# EAGLE schematic DC-Boost 12-24v (EAGLE 7.1.0)
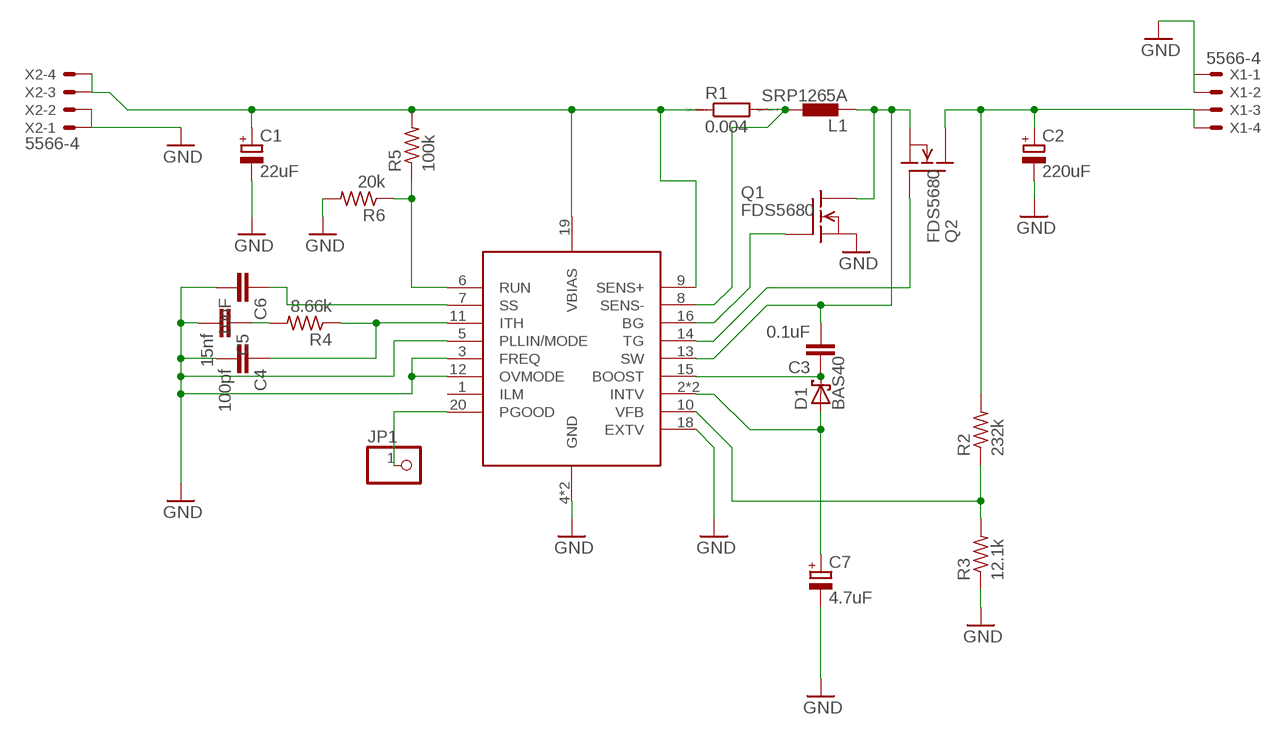
[diagram p0: schematic, sheet 1]

## Parts
C1  22uF  CPOL-EUE2-5  [E2-5]
C2  220uF  CPOL-EUTT5D10  [TT5D10]
C3  0.1uF  C5/3  [C5B3]
C4  100pf  C5/3.5  [C5B3.5]
C5  15nf  C2,5-3  [C2.5-3]
C6  10nF  C5/3  [C5B3]
C7  4.7uF  CPOL-EUE2-5  [E2-5]
D1  BAS40  [SOT23]
JP1  PINHD-1X1  [1X01]
L1  SRP1265A  [SRP1265]
Q1  FDS5680  [SO-8]
Q2  FDS5680  [SO-8]
R1  0.004  RR2512  [R2512]
R2  232k  R-US_0207/10  [0207/10]
R3  12.1k  R-US_0207/10  [0207/10]
R4  8.66k  R-US_0207/10  [0207/10]
R5  100k  R-US_0207/10  [0207/10]
R6  20k  R-US_0207/10  [0207/10]
U$1  LTC3769  [TSSOP-20]
X1  5566-4  [5566-4]
X2  5566-4  [5566-4]

## Nets
GND: C1.- C2.- C4.2 C5.2 C6.2 C7.- Q1.1(S) Q1.2(S) Q1.3(S) R3.1 R6.2 U$1.3(FREQ) U$1.4(GND) U$1.5(PLLIN/MODE) U$1.12(OVMODE) U$1.18(EXTV) U$1.21(GND) X1.1 X1.2 X2.1 X2.2
N$1: C6.1 U$1.7(SS)
N$2: C4.1 R4.1 U$1.11(ITH)
N$3: C5.1 R4.2
N$4: R2.1 R3.2 U$1.10(VFB)
N$5: Q2.4(G) U$1.14(TG)
N$6: C2.+ Q2.5(D) Q2.6(D) Q2.7(D) Q2.8(D) R2.2 X1.3 X1.4
N$7: R5.1 R6.1 U$1.6(RUN)
N$8: Q1.4(G) U$1.16(BG)
N$9: L1.P$3 R1.2 U$1.8(SENS-)
N$10: C3.2 L1.P$1 Q1.5(D) Q1.6(D) Q1.7(D) Q1.8(D) Q2.1(S) Q2.2(S) Q2.3(S) U$1.13(SW)
N$11: C7.+ D1.1(A) U$1.2(INTV) U$1.17(INTV)
N$12: C3.1 D1.3(C) U$1.15(BOOST)
N$13: JP1.1 U$1.20(PGOOD)
N$15: C1.+ R1.1 R5.2 U$1.9(SENS+) U$1.19(VBIAS) X2.3 X2.4
Unconnected: U$1.1(ILM)

## Library data of the parts
C1 C2 C7 = resistor:CPOL-EU: POLARIZED CAPACITOR, European symbol
C3-C6 = capacitor-wima:C: CAPACITOR naming: grid - package width
D1 = diode:BAS40: Silicon Schottky Diodes General-purpose diode for high-speed switching
JP1 = pinhead:PINHD-1X1: PIN HEADER
L1 = inductors:SRP1265A
Q1 Q2 = transistor-fet:FDS5680: 60V N-Channel PowerTrench TM MOSFET FAIRCHILD FDS5680.pdf
R1 = eagle-ltspice:R: RESISTOR, European symbol; SPICEMODEL: NONE; SPICEPREFIX: R
R2-R6 = rcl:R-US_: RESISTOR, American symbol
U$1 = LTC3769:LTC3769: Boost Controller 60V Low IQ Synchronous http://cds.linear.com/docs/en/datasheet/3769f.pdf
X1 X2 = con-molex:5566-4: Mini FIT connector 4 pol Source: http://www.molex.com; OC_FARNELL: unknown; OC_NEWARK: unknown